# Altium project ROBOT_v2.PrjPcb
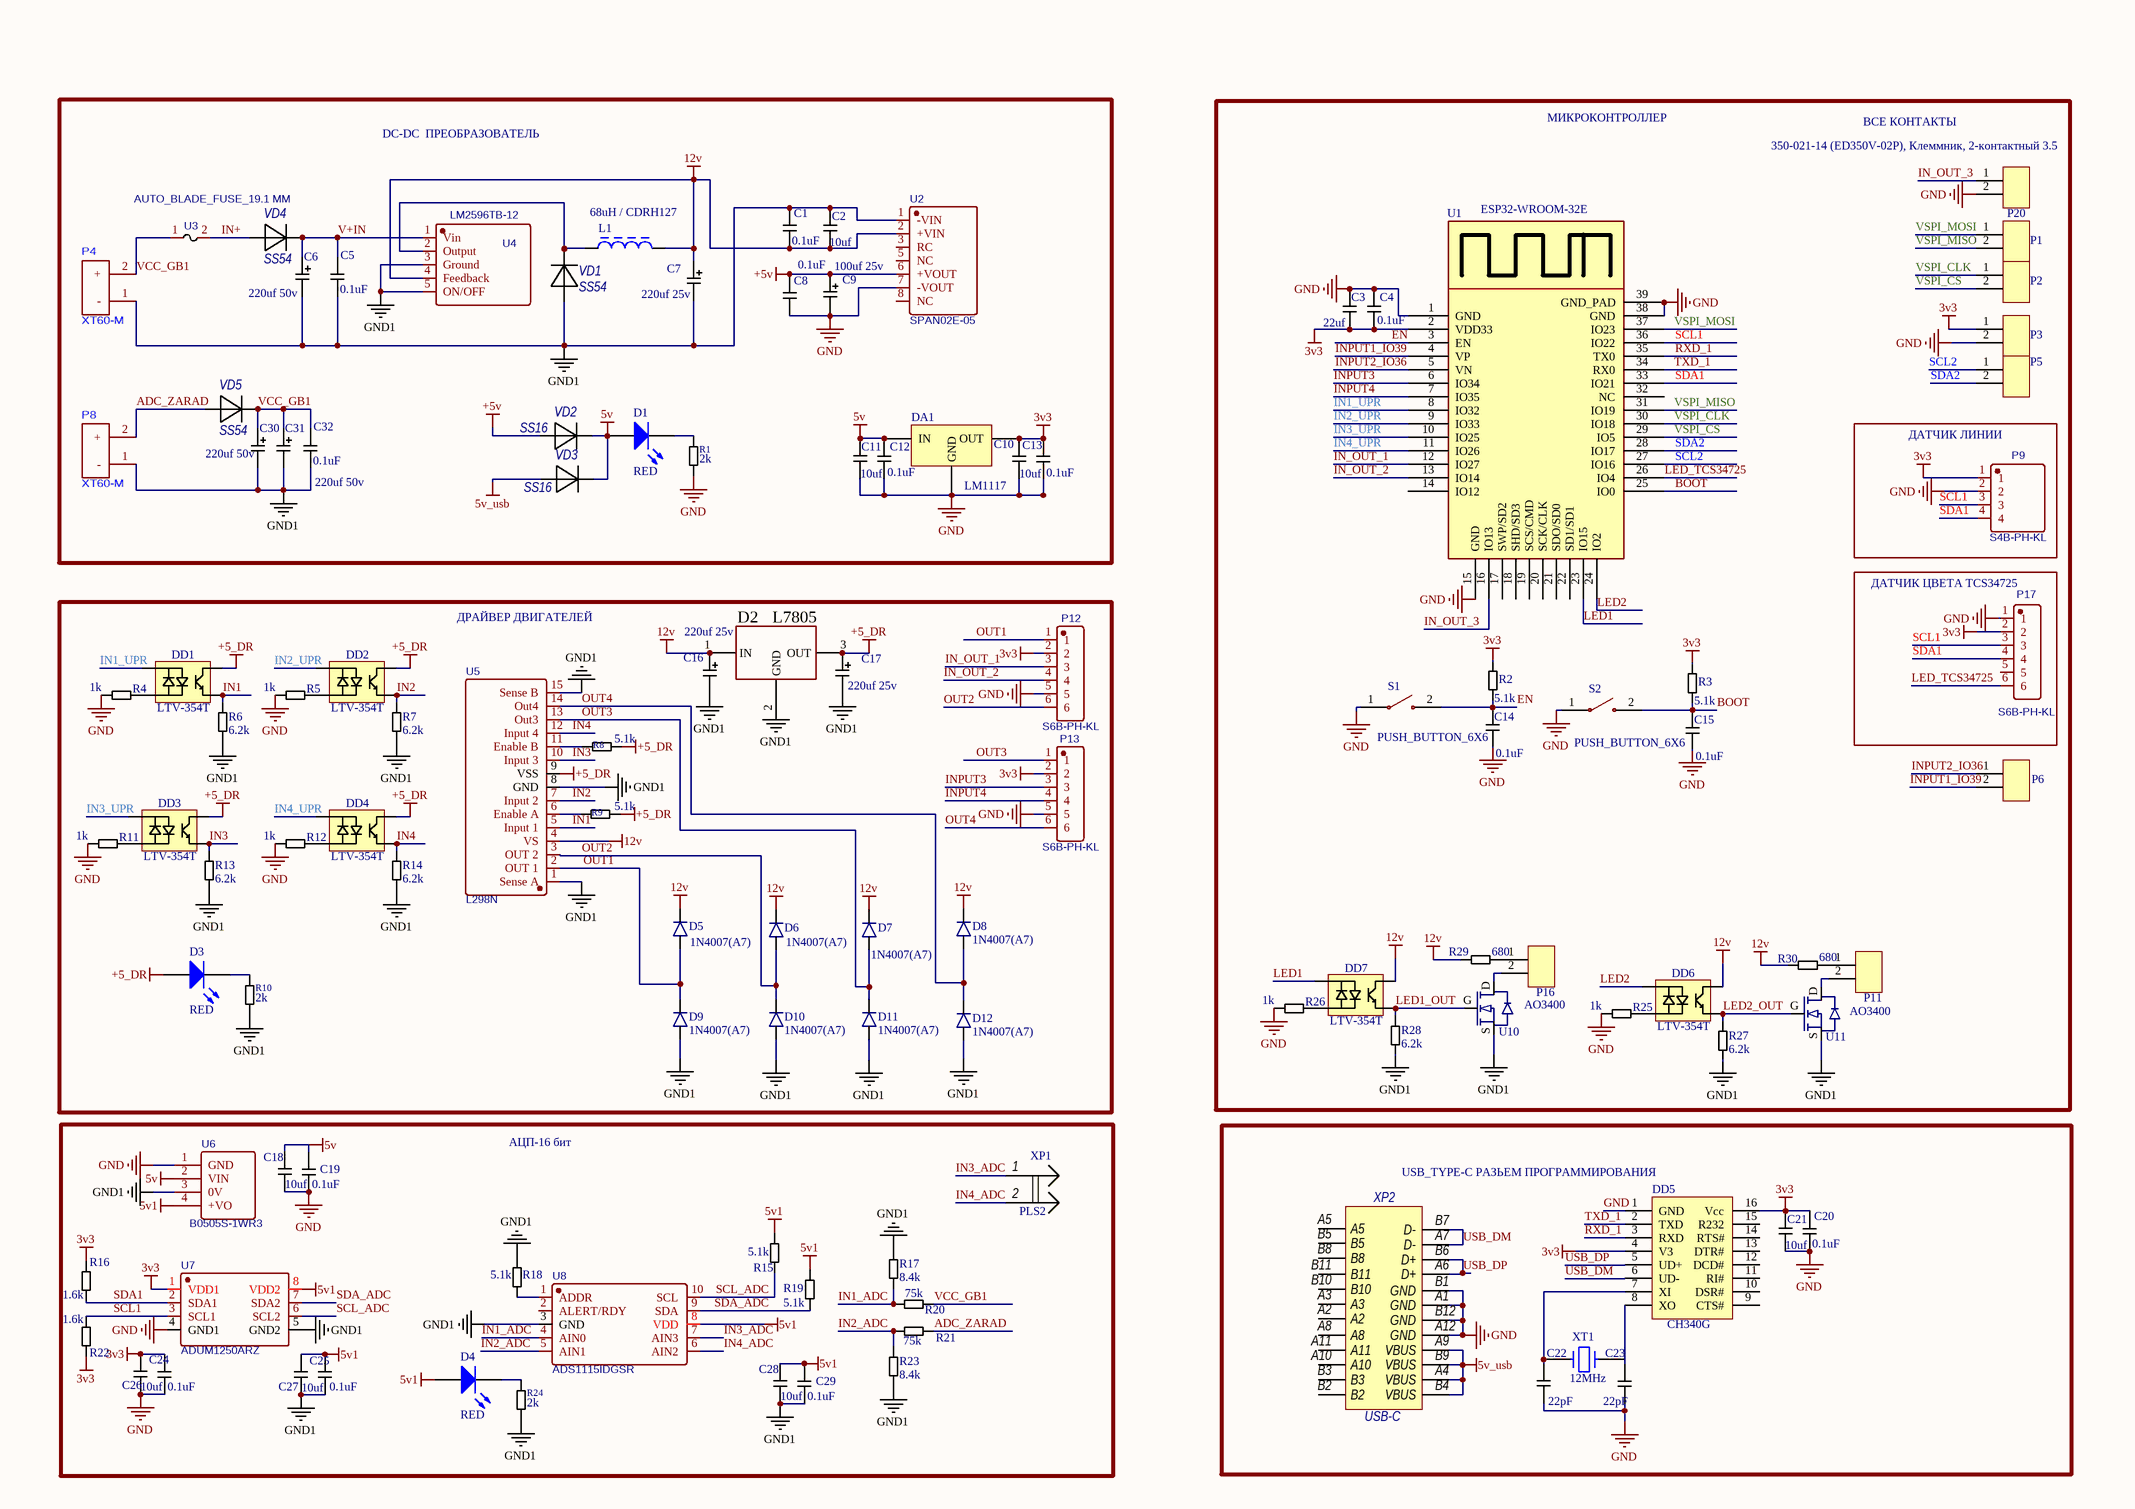
[diagram p0: ROBOT_SCH_v2.SchDoc]
1 sheet, 117 parts. Net scope: global (net labels, ports and power ports of the same name join across sheets).
Board file: ROBOT_PCB_V2.PcbDoc

## Sheet ROBOT_SCH_v2.SchDoc
size A3; Address1: Address1; Address2: Address2; Address3: Address3; Address4: Address4; DocumentNumber: АБВГ.123456.001 Э3; SheetNumber: 1; Scale: 1:1; DocumentType: Схема электрическая принципиальная; FirstReferrence: АБВГ.123456.001

### Parts
C1  0.1uF  [C0805]
C2  10uf  [C0805]
C3  22uf  [C0805]
C4  0.1uF  [C0805]
C5  0.1uF  [C0805]
C6  220uf 50v  [C_EL_10]
C7  220uf 25v  [C_EL_8]
C8  0.1uF  [C0805]
C9  100uf 25v  [C_EL_8]
C10  10uf  [C0805]
C11  10uf  [C0805]
C12  0.1uF  [C0805]
C13  0.1uF  [C0805]
C14  0.1uF  [C0805]
C15  0.1uF  [C0805]
C16  220uf 25v  [C_EL_8]
C17  220uf 25v  [C_EL_8]
C18  10uf  [C0805]
C19  0.1uF  [C0805]
C20  0.1uF  [C0805]
C21  10uf  [C0805]
C22  22pF  [C0805]
C23  22pF  [C0805]
C24  0.1uF  [C0805]
C25  0.1uF  [C0805]
C26  10uf  [C0805]
C27  10uf  [C0805]
C28  10uf  [C0805]
C29  0.1uF  [C0805]
C30  220uf 50v  [C_EL_10]
C31  220uf 50v  [C_EL_10]
C32  0.1uF  [C0805]
D1  RED  [LED0805]
D2  L7805  [DPAK]
D3  RED  [LED0805]
D4  RED  [LED0805]
D5  1N4007(A7)  [SOD-123FL]
D6  1N4007(A7)  [SOD-123FL]
D7  1N4007(A7)  [SOD-123FL]
D8  1N4007(A7)  [SOD-123FL]
D9  1N4007(A7)  [SOD-123FL]
D10  1N4007(A7)  [SOD-123FL]
D11  1N4007(A7)  [SOD-123FL]
D12  1N4007(A7)  [SOD-123FL]
DA1  LM1117  [SOT-223]
DD1  LTV-354T  [LTV-354T]
DD2  LTV-354T  [LTV-354T]
DD3  LTV-354T  [LTV-354T]
DD4  LTV-354T  [LTV-354T]
DD5  CH340G  [SO-16]
DD6  LTV-354T  [LTV-354T]
DD7  LTV-354T  [LTV-354T]
L1  68uH / CDRH127  [CDRH127]
P1  AA  [DG350-3.5-02]  (value not drawn)
P2  AA  [DG350-3.5-02]  (value not drawn)
P3  AA  [DG350-3.5-02]  (value not drawn)
P4  XT60-M  [AMASS_XT60-M]
P5  AA  [DG350-3.5-02]  (value not drawn)
P6  AA  [DG350-3.5-02]  (value not drawn)
P8  XT60-M  [AMASS_XT60-M]
P9  S4B-PH-KL  [CONN-TH_B4B-PH-K-LF-SN]
P11  AA  [DG350-3.5-02]  (value not drawn)
P12  S6B-PH-KL  [CONN-TH_B6B-PH-KL-LF-SN]
P13  S6B-PH-KL  [CONN-TH_B6B-PH-KL-LF-SN]
P16  AA  [DG350-3.5-02]  (value not drawn)
P17  S6B-PH-KL  [CONN-TH_B6B-PH-KL-LF-SN]
P20  350-021-14 (ED350V-02P), Клеммник, 2-контактный 3.5  [DG350-3.5-02]
R1  2k  [R0805]
R2  5.1k  [R0805]
R3  5.1k  [R0805]
R4  1k  [R0805]
R5  1k  [R0805]
R6  6.2k  [R0805]
R7  6.2k  [R0805]
R8  5.1k  [R0805]
R9  5.1k  [R0805]
R10  2k  [R0805]
R11  1k  [R0805]
R12  1k  [R0805]
R13  6.2k  [R0805]
R14  6.2k  [R0805]
R15  5.1k  [R0805]
R16  1.6k  [R0805]
R17  8.4k  [R0805]
R18  5.1k  [R0805]
R19  5.1k  [R0805]
R20  75k  [R0805]
R21  75k  [R0805]
R22  1.6k  [R0805]
R23  8.4k  [R0805]
R24  2k  [R0805]
R25  1k  [R0805]
R26  1k  [R0805]
R27  6.2k  [R0805]
R28  6.2k  [R0805]
R29  680  [R0805]
R30  680  [R0805]
S1  PUSH_BUTTON_6X6  [PUSH_BUTTON_6X6]
S2  PUSH_BUTTON_6X6  [PUSH_BUTTON_6X6]
U1  ESP32-WROOM-32E  [ESP32-WROOM-32D]
U2  SPAN02E-05  [PWRM-TH_7P-L21.8-W9.2-P2.50_WRA0512S-3WR2]
U3  AUTO_BLADE_FUSE_19.1 MM  [AUTOMOTIVE BLADE FUSE 19.1MM]
U4  LM2596TB-12  [TO-220-5_L10.2-W4.8-P1.70-TL]
U5  L298N  [MULTIWATT-15_L19.6-W5.0-P1.27-L]
U6  B0505S-1WR3  [PWRM-TH_B0503S-1WR2]
U7  ADUM1250ARZ  [SOP8]
U8  ADS1115IDGSR  [VSSOP-10_L3.0-W3.0-P0.50-LS4.9-BL]
U10  AO3400  [SOT23-3]
U11  AO3400  [SOT23-3]
VD1  SS54  [DO-214AC]
VD2  SS16  [DO-214AC]
VD3  SS16  [DO-214AC]
VD4  SS54  [DO-214AC]
VD5  SS54  [DO-214AC]
XP1  PLS2  [PLS-2]
XP2  USB-C  [16PF-026]
XT1  12MHz  [OSC_49HSMD_1]

### Blocks framed on the sheet
DC-DC  ПРЕОБРАЗОВАТЕЛЬ: C1 C2 C5-C13 C30-C32 D1 DA1 L1 P4 P8 R1 U2-U4 VD1-VD5
ДАТЧИК ЛИНИИ: P9
ДРАЙВЕР ДВИГАТЕЛЕЙ: C16 C17 D2 D3 D5-D12 DD1-DD4 P12 P13 R4-R14 U5
ДАТЧИК ЦВЕТА TCS34725: P17
АЦП-16 бит: C18 C19 C24-C29 D4 R15-R24 U6-U8 XP1
USB_TYPE-C РАЗЬЕМ ПРОГРАММИРОВАНИЯ: C20-C23 DD5 XP2 XT1

### Nets
3v3: C3.1 C4.1 C10.2 C13.2 C20.2 C21.2 C24.2 C26.2 DA1.2(OUT) DD5.4(V3) DD5.16(Vcc) P3.1 P9.1 P12.2 P13.2 P17.2 R2.1 R3.1 R16.2 R22.1 U1.2(VDD33) U7.1(VDD1)
5v: C11.2 C12.2 C18.2 C19.2 D1.A DA1.3(IN) U6.2(VIN) VD2.C VD3.C
5v1: C25.2 C27.2 C28.2 C29.2 D4.A R15.1 R19.1 U6.4(+VO) U7.8(VDD2) U8.8(VDD)
5v_usb: VD3.A XP2.A4(VBUS) XP2.A9(VBUS) XP2.B4(VBUS) XP2.B9(VBUS)
12v: C1.1 C2.1 C7.1 C16.1 D2.1(IN) D5.2 D6.2 D7.2 D8.2 DD6.4(Emitter) DD7.4(Emitter) L1.2 R29.2 R30.2 U2.2(+VIN) U4.4(Feedback) U5.4(VS)
+5_DR: C17.1 D2.3(OUT) D3.A DD1.4(Emitter) DD2.4(Emitter) DD3.4(Emitter) DD4.4(Emitter) R8.1 R9.1 U5.9(VSS)
+5v: C8.2 C9.1 U2.6(+VOUT) VD2.A
GND: C3.2 C4.2 C8.1 C9.2 C10.1 C11.1 C12.1 C13.1 C14.2 C15.2 C18.1 C19.1 C20.1 C21.1 C22.2 C23.2 C24.1 C26.1 DA1.1(GND) DD5.1(GND) P3.2 P9.2 P12.5 P13.5 P17.1 P20.2 R1.1 R4.2 R5.2 R11.2 R12.2 R25.2 R26.2 S1.1 S2.1 U1.1(GND) U1.15(GND) U1.38(GND) U1.39(GND_PAD) U2.7(-VOUT) U6.1(GND) U7.4(GND1) XP2.A1(GND) XP2.A12(GND) XP2.B1(GND) XP2.B12(GND)
GND1: C1.2 C2.2 C5.1 C6.2 C7.2 C16.2 C17.2 C25.1 C27.1 C28.1 C29.1 C30.2 C31.2 C32.1 D2.2(GND) D9.1 D10.1 D11.1 D12.1 P4.1(-) P8.1(-) R6.1 R7.1 R10.1 R13.1 R14.1 R17.2 R18.1 R23.2 R24.1 R27.1 R28.1 U2.1(-VIN) U4.3(Ground) U4.5(ON/OFF) U5.1(Sense_A) U5.8(GND) U5.15(Sense_B) U6.3(0V) U7.5(GND2) U8.3(GND) U10.S U11.S VD1.A
ADC_ZARAD: P8.2(+) R21.2 VD5.A
BOOT: C15.1 R3.2 S2.2 U1.25(IO0)
EN: C14.1 R2.2 S1.2 U1.3(EN)
IN1: DD1.3(Collector) R6.2 U5.5(Input_1)
IN1_ADC: R17.1 R20.1 U8.4(AIN0)
IN1_UPR: DD1.1(Andoe) U1.8(IO32)
IN2: DD2.3(Collector) R7.2 U5.7(Input_2)
IN2_ADC: R21.1 R23.1 U8.5(AIN1)
IN2_UPR: DD2.1(Andoe) U1.9(IO33)
IN3: DD3.3(Collector) R13.2 U5.10(Input_3)
IN3_ADC: U8.7(AIN3) XP1.1
IN3_UPR: DD3.1(Andoe) U1.10(IO25)
IN4: DD4.3(Collector) R14.2 U5.12(Input_4)
IN4_ADC: U8.6(AIN2) XP1.2
IN4_UPR: DD4.1(Andoe) U1.11(IO26)
IN+: U3.2 VD4.A
IN_OUT_1: P12.3 U1.12(IO27)
IN_OUT_2: P12.4 U1.13(IO14)
IN_OUT_3: P20.1 U1.16(IO13)
INPUT1_IO39: P6.2 U1.4(VP)
INPUT2_IO36: P6.1 U1.5(VN)
INPUT3: P13.3 U1.6(IO34)
INPUT4: P13.4 U1.7(IO35)
LED1: DD7.1(Andoe) U1.23(IO15)
LED1_OUT: DD7.3(Collector) R28.2 U10.G
LED2: DD6.1(Andoe) U1.24(IO2)
LED2_OUT: DD6.3(Collector) R27.2 U11.G
LED_TCS34725: P17.6 U1.26(IO4)
OUT1: D5.1 D9.2 P12.1 U5.2(OUT_1)
OUT2: D6.1 D10.2 P12.6 U5.3(OUT_2)
OUT3: D7.1 D11.2 P13.1 U5.13(Out3)
OUT4: D8.1 D12.2 P13.6 U5.14(Out4)
RXD_1: DD5.3(RXD) U1.35(TX0)
SCL1: P9.3 P17.3 R22.2 U1.36(IO22) U7.3(SCL1)
SCL2: P5.1 U1.27(IO16)
SCL_ADC: R15.2 U7.6(SCL2) U8.10(SCL)
SDA1: P9.4 P17.4 R16.1 U1.33(IO21) U7.2(SDA1)
SDA2: P5.2 U1.28(IO17)
SDA_ADC: R19.2 U7.7(SDA2) U8.9(SDA)
TXD_1: DD5.2(TXD) U1.34(RX0)
USB_DM: DD5.6(UD-) XP2.A7(D-) XP2.B7(D-)
USB_DP: DD5.5(UD+) XP2.A6(D+) XP2.B6(D+)
V+IN: C5.2 C6.1 U4.1(Vin) VD4.C
VCC_GB1: C30.1 C31.1 C32.2 P4.2(+) R20.2 U3.1 VD5.C
VSPI_CLK: P2.1 U1.30(IO18)
VSPI_CS: P2.2 U1.29(IO5)
VSPI_MISO: P1.2 U1.31(IO19)
VSPI_MOSI: P1.1 U1.37(IO23)
NetC22_1: C22.1 DD5.7(XI) XT1.1
NetC23_1: C23.1 DD5.8(XO) XT1.2
NetD1_K: D1.K R1.2
NetD3_K: D3.K R10.2
NetD4_K: D4.K R24.2
NetDD1_2: DD1.2(Cathode) R4.1
NetDD2_2: DD2.2(Cathode) R5.1
NetDD3_2: DD3.2(Cathode) R11.1
NetDD4_2: DD4.2(Cathode) R12.1
NetDD6_2: DD6.2(Cathode) R25.1
NetDD7_2: DD7.2(Cathode) R26.1
NetL1_1: L1.1 U4.2(Output) VD1.C
NetP11_1: P11.1 R30.1
NetP11_2: P11.2 U11.D
NetP16_1: P16.1 R29.1
NetP16_2: P16.2 U10.D
NetR8_2: R8.2 U5.11(Enable_B)
NetR9_2: R9.2 U5.6(Enable_A)
NetR18_2: R18.2 U8.1(ADDR)

Not connected (* = marked no-connect by the designer): DD5 9(CTS#) 10(DSR#) 11(RI#) 12(DCD#) 13(DTR#) 14(RTS#) 15(R232); P17 5; U1 14(IO12) 17(SWP/SD2) 18(SHD/SD3) 19(SCS/CMD) 20(SCK/CLK) 21(SDO/SD0) 22(SD1/SD1) 32(NC); U2 3(RC) 5(NC) 8(NC); U8 2(ALERT/RDY); XP2 A2 A3 A5 A8 A10 A11 B2 B3 B5 B8 B10 B11

### Notes on the sheet
- МИКРОКОНТРОЛЛЕР
- ВСЕ КОНТАКТЫ
- Перв. примен.
- Справ. №
- Подп. и дата
- Инв. № дубл.
- Взам. инв. №
- Разраб.
- Изм.
- Лист
- № докум.
- Подп.
- Дата
- Лит.
- Масса
- Масштаб
- Пров.
- Т.контр.
- Листов
- Инв. № подл.
- Утв.
- Н.контр.
- 2.106-A1
- Копировал
- Формат А0

### Library data of the parts
C1-C5 C8 C10-C15 C18-C29 C32 = C: Capacitor
C6 C30 C31 = CP: ECAP SMD, 220 мкФ, 50 В, 105°C, 20% 10x10.5мм, JCK1H221M100105, Конденсатор электролитический алюминиевый SMD  https://www.chipdip.ru/product0/9000565744
C7 C16 C17 = CP: ECAP SMD, 220 мкФ, 25 В, 105°C, 20% 8x10.5мм, JCK1E221M080105, Конденсатор электролитический алюминиевый SMD / https://www.chipdip.ru/product0/9000565742
C9 = CP: ECAP SMD, 100 мкФ, 25 В, 105°C, 20% 6.3x7.7мм, JCK1E101M063077, Конденсатор электролитический алюминиевый SMD   https://www.chipdip.ru/product0/9000565736
D1 D3 D4 = LED0: Typical INFRARED GaAs LED; Published: 8-Jun-2000; LatestRevisionDate: 08-Jul-2005; LatestRevisionNote: Mech Layer 1 removed.; PackageReference: LED-0; Publisher: Altium Limited; PackageDescription: LED; 2 Leads
D2 = L7805: Линейный стабилизатор
D5-D12 = 1N4007: Rectifier Diode 1000V 1A 1N4007(A7); Mouser PN: 637-1N4007; ComponentLink1Description: Datasheet; ComponentLink1URL: https://www.mouser.com/datasheet/2/849/1n4001-2577232.pdf; Digikey PN: 4617-1N4007TB-ND; JLCPCB PN: C3033995
DA1 = LM1117: 3.3V 800mA LDO
DD1-DD4 DD6 DD7 = LTV-354T: optron 1x
DD5 = CH340G: USB-UART
L1 = L: CDRH127/LDNP-680MC, (68uH 2.6A), Силовая SMD индуктивность 68мкГн +20% 2.6A 0.092Ом c магнитным экраном   https://www.chipdip.ru/product0/8006796852?ysclid=m3ged06qe2955158669
P1-P3 P5 P6 P11 P16 P20 = SIP2: 350-021-14 (ED350V-02P), Клеммник, 2-контактный 3.5         https://www.chipdip.ru/product/350-021-14-ed350v-02p
P9 = S4B-PH-KL: Manufacturer: JST; Manufacturer Part: S4B-PH-KL(LF)(SN); Contributor: LCSC; Supplier: LCSC; Supplier Part: C160235; JLCPCB Part Class: Extended Part; spicePre: U; spiceSymbolName: S4B-PH-KL(LF)(SN)
P12 P13 P17 = S6B-PH-KL: Manufacturer: JST; Contributor: lcsc; Supplier: LCSC; Supplier Part: C20089288; Manufacturer Part: S6B-PH-KL; JLCPCB Part Class: Extended Part; spicePre: C; spiceSymbolName: S6B-PH-KL
R1-R30 = R: Resistor
S1 S2 = PUSH_BUTTON_6X6: Push Button Tactile Switch PTH 4 Pins 6x6mm.; JLCPCB PN: C255811
U1 = ESP32-WROOM-32D: Chip SMD 39 Pads Wifi 2.4GHz BLE 4.2 18x25.5mm w/ Antenna.; Mouser PN: ESP32-WROOM-32D-N4; Digikey PN: 1965-ESP32-WROOM-32D-N8CT-ND; ComponentLink1Description: Datasheet; ComponentLink1URL: https://www.mouser.com/datasheet/2/891/esp32_wroom_32d_esp32_wroom_32u_datasheet_en-1365844.pdf; JLCPCB PN: C82899
U2 = SPAN02A-05: Manufacturer: MW(明纬); Contributor: lcsc; Supplier: LCSC; Supplier Part: C5354451; Manufacturer Part: SPAN02A-05; JLCPCB Part Class: Extended Part; spicePre: U; spiceSymbolName: SPAN02A-05
U3 = AUTO_BLADE_FUSE_19.1 MM: Contributor: handollkwk16; spicePre: U; spiceSymbolName: AUTO_BLADE_FUSE_19.1 MM
U4 = LM2596TB-12: Manufacturer: HGSEMI(华冠); Contributor: lcsc; Supplier: LCSC; Supplier Part: C5160079; Manufacturer Part: LM2596TB-12; spicePre: U; spiceSymbolName: LM2596TB-12
U5 = L298N: Manufacturer: HGSEMI(华冠); Contributor: LCSC; Supplier: LCSC; Supplier Part: C434589; Manufacturer Part: L298N; JLCPCB Part Class: Extended Part; spicePre: U; spiceSymbolName: L298N
U6 = B0505S-1WR3: Manufacturer: MORNSUN(金升阳); Supplier: LCSC; Manufacturer Part: B0505S-1WR3; Supplier Part: C131038; JLCPCB Part Class: Extended Part; spicePre: U; spiceSymbolName: B0505S-1WR3
U7 = ADUM1250ARZ: Manufacturer: ADI(亚德诺); Manufacturer Part: ADUM1250ARZ-RL7; spicePre: X; Supplier: LCSC; Supplier Part: C13839; JLCPCB Part Class: Extended Part; spiceSymbolName: ADUM1250ARZ
U8 = ADS1115IDGSR: Manufacturer: TI(德州仪器); Manufacturer Part: ADS1115IDGST; Contributor: LCSC; Supplier: LCSC; Supplier Part: C468683; JLCPCB Part Class: Extended Part; spicePre: U; spiceSymbolName: ADS1115IDGST
U10 U11 = AO3400: Mosfet NPN
VD1 VD4 VD5 = DIODE
VD2 VD3 = DIODE: https://www.chipdip.ru/product/1n4007-m7
XP1 = PLS-2
XT1 = CRYSTAL